# EAGLE schematic roomba_led_pcb_v1 (EAGLE 9.5.2)
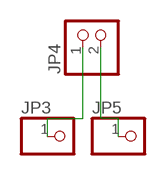
[diagram p0: schematic, sheet 1]

## Parts
JP3  PINHD-1X1  [1X01]
JP4  PINHD-1X2/90  [1X02/90]
JP5  PINHD-1X1  [1X01]

## Nets
N$1: JP3.1 JP4.1
N$2: JP4.2 JP5.1

## Library data of the parts
JP3 JP5 = pinhead_new:PINHD-1X1: PIN HEADER
JP4 = pinhead:PINHD-1X2: PIN HEADER